# EAGLE design blinky (EAGLE 9.6.2)
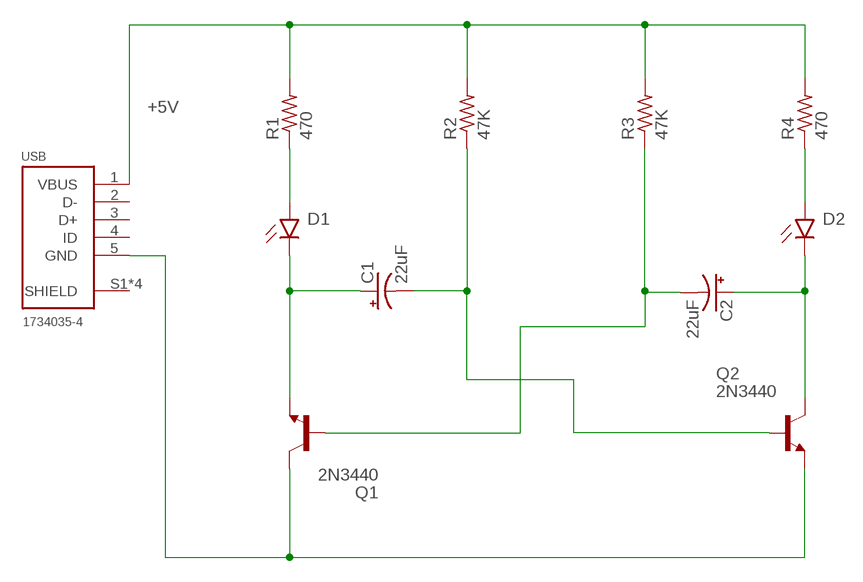
[diagram p0: schematic, sheet 1]

## Parts
C1  22uF  CPOL-USB45181A  [B45181A]
C2  22uF  CPOL-USB45181A  [B45181A]
D1  CHIP-FLAT-R_1206  [LEDC3216X75N_FLAT-R]
D2  CHIP-FLAT-G_1206  [LEDC3216X75N_FLAT-G]
Q1  2N3440  [TO5]
Q2  2N3440  [TO5]
R1  470  R-US_0204/7  [0204/7]
R2  47K  R-US_0204/7  [0204/7]
R3  47K  R-US_0204/7  [0204/7]
R4  470  R-US_0204/7  [0204/7]
USB  1734035-4  [1734035-4]

## Nets
+5V: R1.2 R2.2 R3.2 R4.2 USB.1(VBUS)
N$2: D1.A R1.1
N$3: D2.A R4.1
N$4: C1.+ D1.C Q1.1(E)
N$5: C1.- Q2.2(B) R2.1
N$6: C2.+ D2.C Q2.3(C)
N$7: C2.- Q1.2(B) R3.1
N$9: Q1.3(C) Q2.1(E) USB.5(GND)
Unconnected: USB.2(D-) USB.3(D+) USB.4(ID)

## Power pins joined to a net without a drawn wire
SHIELD: USB.S1(SHIELD) USB.S2(SHIELD) USB.S3(SHIELD) USB.S4(SHIELD)

## Library data of the parts
C1 C2 = rcl:CPOL-US: POLARIZED CAPACITOR, American symbol; SPICEPREFIX: C
D1 = LED:CHIP-FLAT-R; CATEGORY: LED; COLOR: RED; DESCRIPTION: CHIP LED FLAT; SUB-CATEGORY: CHIP; TYPE: FLAT_TOP
D2 = LED:CHIP-FLAT-G; CATEGORY: LED; COLOR: GREEN; DESCRIPTION: CHIP LED FLAT; SUB-CATEGORY: CHIP; TYPE: FLAT_TOP
Q1 Q2 = transistor:2N3440: NPN TRANSISTOR
R1-R4 = rcl:R-US_: RESISTOR, American symbol; SPICEPREFIX: R
USB = USB connector:1734035-4: CONN RCPT USB2.0 MINI B SMD R/A Manufacturer's datasheet <https://www.te.com/commerce/DocumentDelivery/DDEController?Action=srchrtrv&DocNm=1734035&DocType=Customer+Drawing&DocLang=English>; CREATED_BY: PCBLayout.com; DIGIKEY_PARTNO: A121554TR-ND; MANUFACTURER: TE Connectivity AMP Connectors; MPN: 1734035-4

## Board
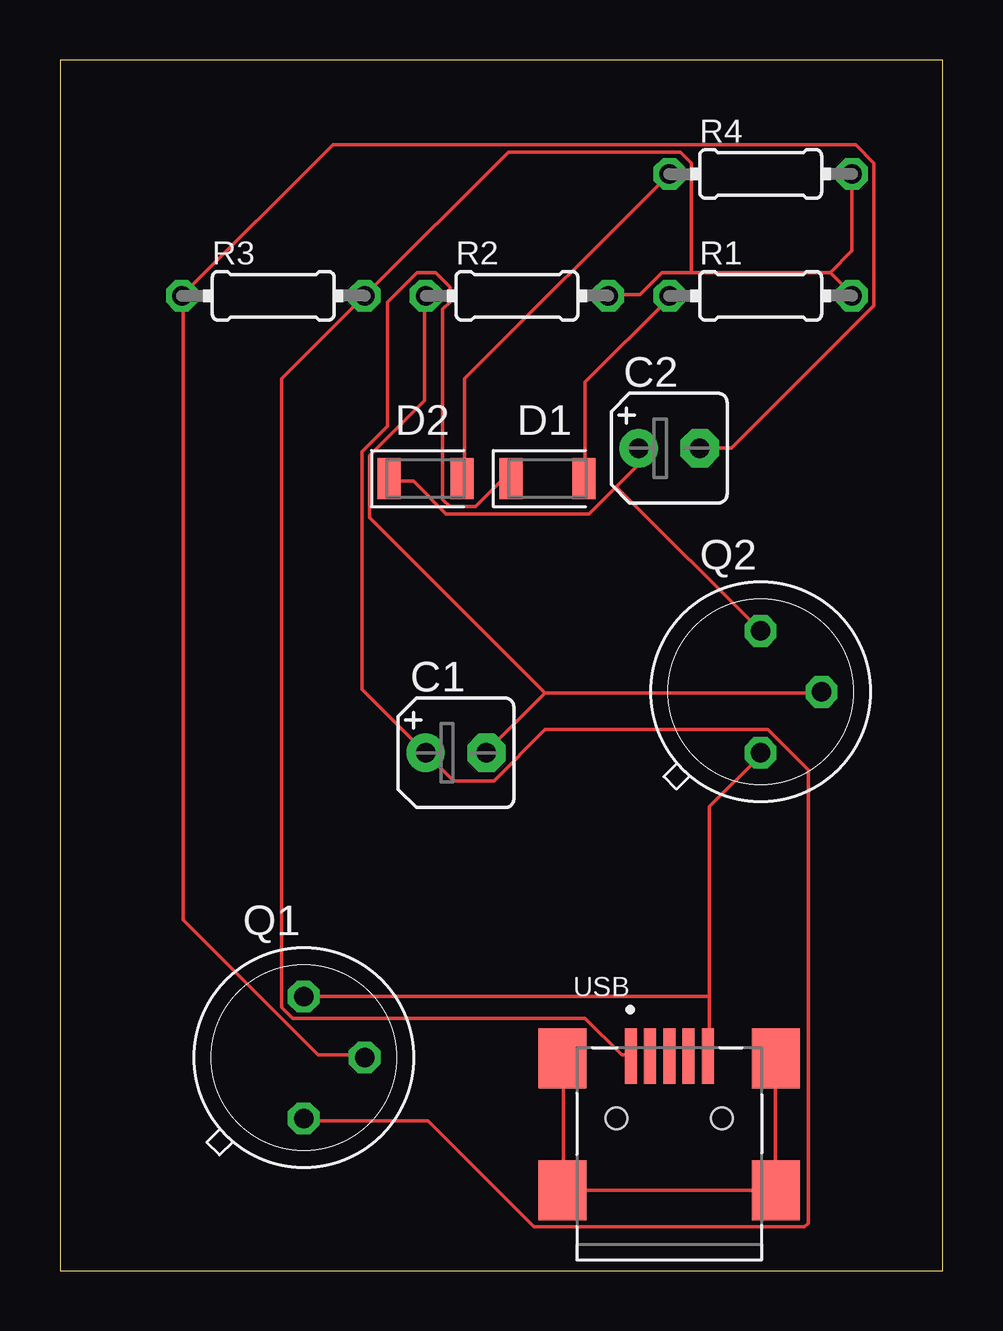
[diagram p1: board, top side]

Size 36.81 x 50.47 mm. Coordinates in mm from the lower left corner, seen from the top.
Outline: 0,0 36.81,0 36.81,50.47 0,50.47 0,0
Copper layers (1*16): Top 0.035mm / dielectric 1.5mm / Bottom 0.035mm
Design rules "default": minimum track width 6mil, minimum drill 0.35mm, track to track 6mil, track to pad 6mil, pad to pad 6mil, via to via 6mil, smd to smd 6mil, copper to edge 40mil, drill to drill 6mil, minimum pad ring 10mil, minimum via ring 8mil, stop-mask expansion 4mil, vias tented up to drill 0mil, thermal gap 10mil

### Footprints (pad centres in the part's own frame; a part is rotated, then mirrored left to right if it is on the bottom)
B45181A = drill 0.813 pad 1.6: + -1.27,0 | drill 0.813 pad 1.6 octagon: - 1.27,0
LEDC3216X75N_FLAT-R = smd 0.962 x 1.712: A 1.525,0; C -1.525,0
LEDC3216X75N_FLAT-G = smd 0.962 x 1.712: A 1.525,0; C -1.525,0
TO5 = drill 0.813 octagon: 1 0,-2.54; 2 2.54,0; 3 0,2.54
0204/7 = drill 0.813 octagon: 1 -3.81,0; 2 3.81,0
1734035-4 = smd 0.5 x 2.3: 1 -1.6,2.6; 2 -0.8,2.6; 3 0,2.6; 4 0.8,2.6; 5 1.6,2.6 | smd 2 x 2.5: S1 -4.45,2.5; S2 4.45,2.5; S3 -4.45,-3; S4 4.45,-3 | hole 0.9: -2.2,0; 2.2,0

### Placement (x,y rotation side)
C1  16.51,21.59 0 top
C2  25.4,34.29 0 top
D1  20.32,33.02 0 top
D2  15.24,33.02 0 top
Q1  10.16,8.89 0 top
Q2  29.21,24.13 0 top
R1  29.21,40.64 0 top
R2  19.05,40.64 0 top
R3  8.89,40.64 0 top
R4  29.21,45.72 0 top
USB  25.4,6.35 0 top

### Tracks (layer width: path | path; a pad name or v marks a point on that pad's centre or on a via)
+5V
  Top 0.152: 32.11,41.6 26.31,41.6 | 26.31,41.6 25.09,41.6 24.18,40.69 22.96,40.69 R2.2 | 32.11,41.6 33.02,40.69 R1.2 | R4.2 33.02,42.52 32.11,41.6 | USB.1 23.72,8.99 23.42,8.99 21.89,10.52 9.7,10.52 9.25,10.97 9.25,37.19 R3.2 18.69,46.63 25.86,46.63 26.31,46.18 26.31,41.6
N$2
  Top 0.152: D1.A 21.89,33.07 21.89,37.03 25.4,40.54 R1.1
N$3
  Top 0.152: R4.1 16.87,37.19 16.87,33.07 D2.A
N$4
  Top 0.152: D1.C 18.69,32.92 18.39,32.92 17.32,31.85 16.26,31.85 15.95,32.16 15.95,40.08 16.26,40.39 16.26,41 15.65,41.6 14.88,41.6 13.67,40.39 13.67,35.2 12.6,34.14 12.6,24.23 C1.+ 16.41,20.42 18.09,20.42 20.22,22.55 29.52,22.55 31.19,20.88 31.19,1.98 31.04,1.83 19.76,1.83 15.34,6.25 10.16,6.25 Q1.1
N$5
  Top 0.152: 20.22,24.08 31.65,24.08 Q2.2 | 20.22,24.08 17.78,21.64 C1.- | 20.22,24.08 12.9,31.39 12.9,33.98 15.19,36.27 15.19,40.54 R2.1
N$6
  Top 0.152: 23.11,32.61 24.03,33.53 24.03,34.29 C2.+ | 23.11,32.61 22.05,31.55 16.1,31.55 14.73,32.92 13.82,32.92 D2.C | Q2.3 23.27,32.61 23.11,32.61
N$7
  Top 0.152: Q1.2 12.6,8.99 10.77,8.99 5.13,14.63 5.13,40.54 R3.1 11.38,46.94 33.17,46.94 33.93,46.18 33.93,40.23 27.99,34.29 C2.-
N$9
  Top 0.152: 27.08,11.43 27.08,19.36 29.21,21.49 Q2.1 | 27.08,11.43 27.08,8.99 USB.5 | 27.08,11.43 Q1.3
SHIELD
  Top 0.152: 20.98,3.35 20.98,8.84 USB.S1 | 29.82,3.35 29.82,8.84 USB.S2 | 29.82,3.35 20.98,3.35 | 20.98,3.35 USB.S3 | 29.82,3.35 USB.S4